# EasyEDA schematic Schematic_Smart watch system.json
TITLE: SMART WATCH SYSTEM; REV: 1.0; Date: 2025-03-30; Sheet: 1/1; Company: HCMUTE
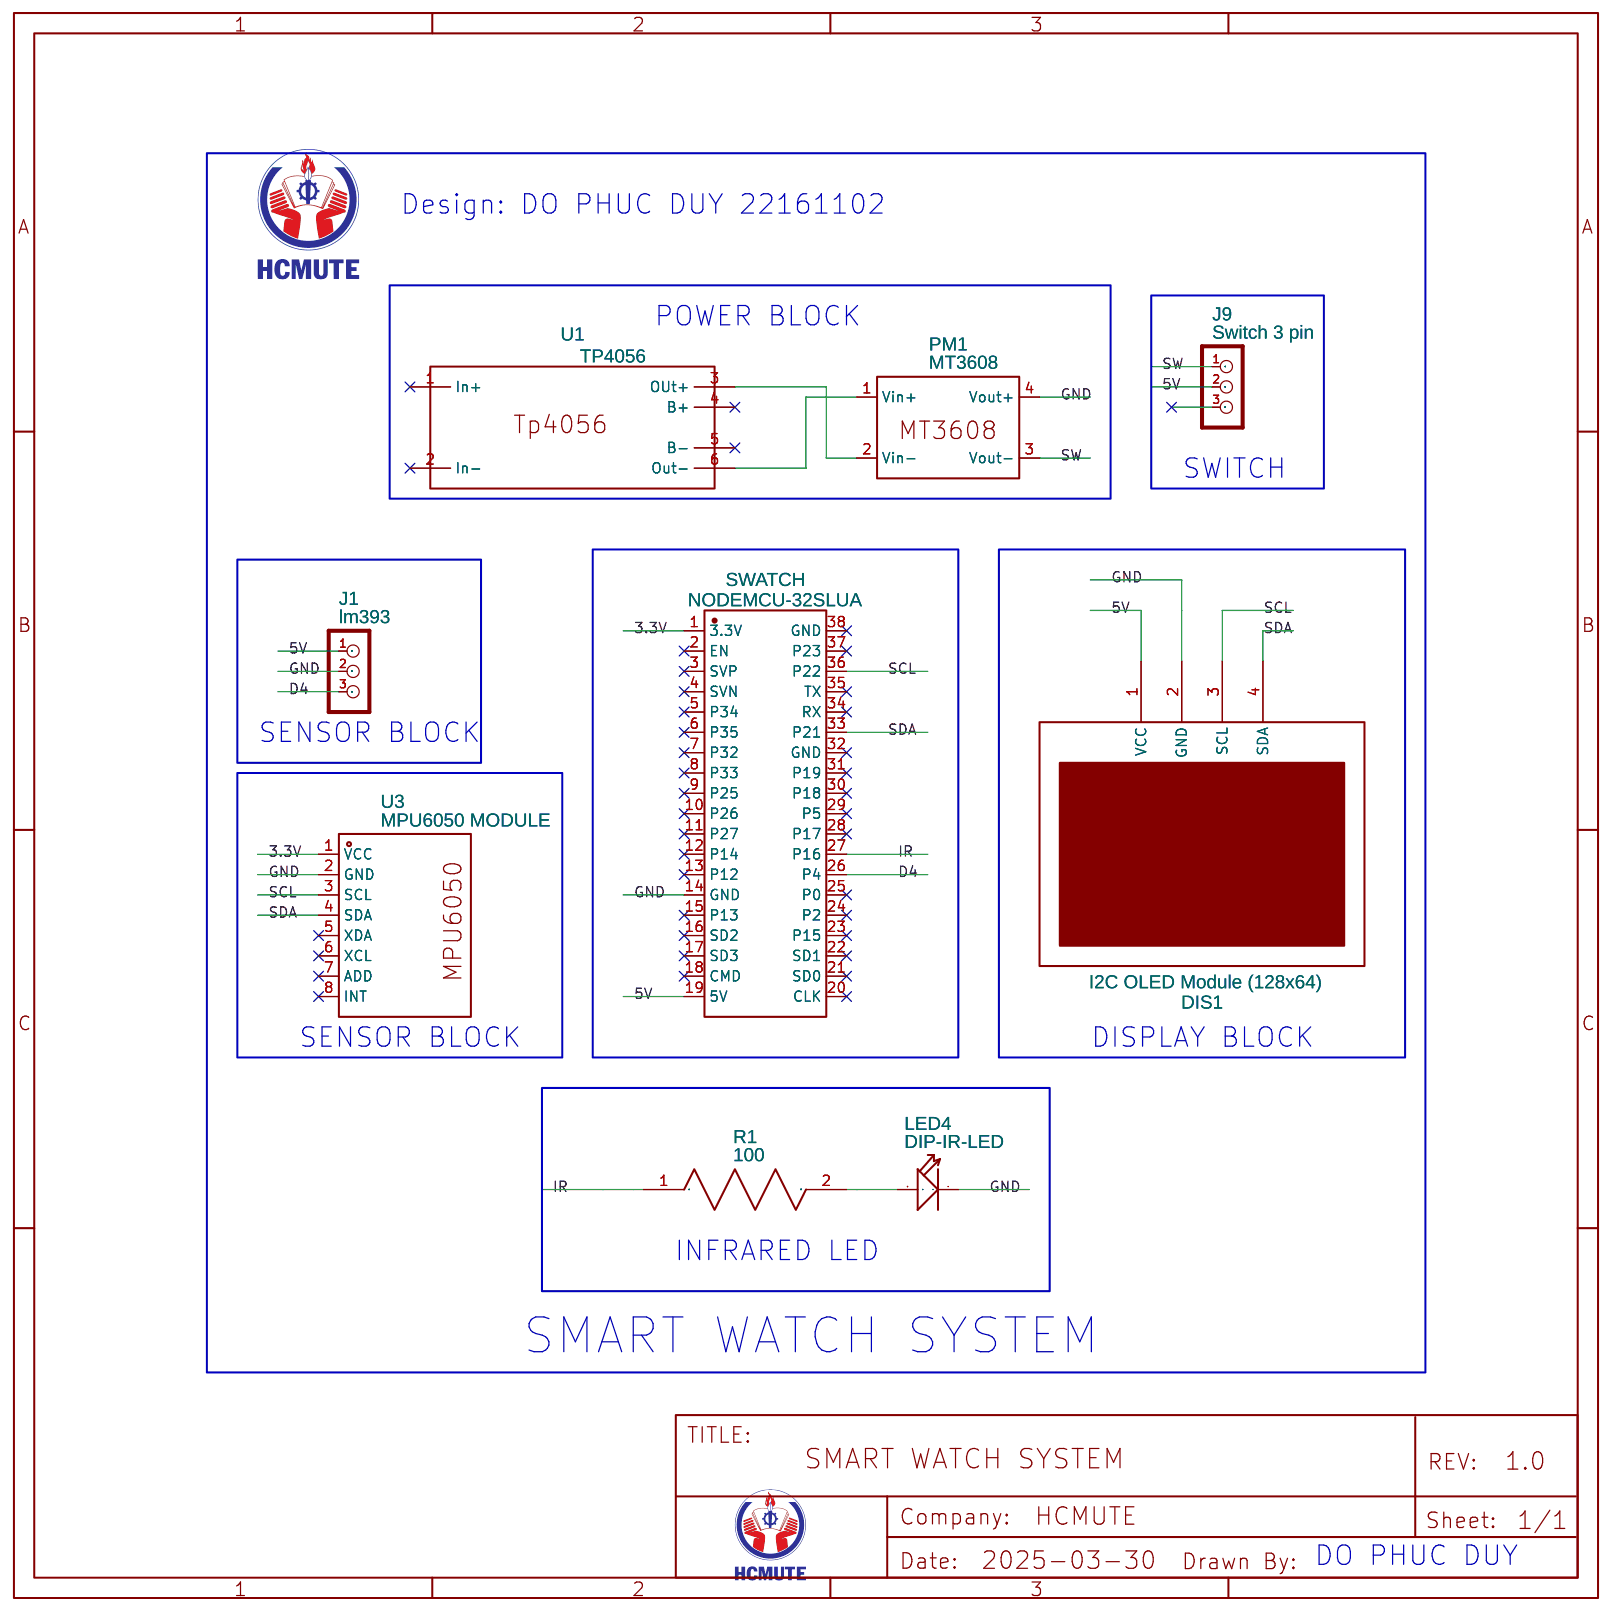
[diagram p0: schematic sheet]

## Parts
DIS1  I2C OLED Module (128x64)  [I2C OLED MODULE (128X64)]
J1  lm393  [M1X3]
J9  Switch 3 pin  [M1X3]
LED4  DIP-IR-LED  [LED2-2.54-D5.0MM]
PM1  MT3608  [MT3608]
R1  100  [R1005]
SWATCH  NODEMCU-32SLUA  [COMM-TH_NODEMCU-32SLUA]
U1  TP4056  [BATTMODULE]
U3  MPU6050 MODULE  [MPU6050]

## Library data of the parts
DIS1 = I2C OLED Module (128x64): Manufacturer Part: SSD1306; link: https://cdn-shop.adafruit.com/datasheets/SSD1306.pdf; Contributor: adzib_mchp
J1 J9 = CON_HEADER_1X03: Contributor: DangerousPrototype
LED4 = DIP-IR-LED-940NM(2P-D5MM): DIP IR LED 940nm; Supplier Part: 304090159; Supplier: SeeedStudio; Manufacturer Part: IR523B-W60W1; sourceId: iIBTN5nFX
PM1 = MT3608 MODULE_new: Supplier: AliExpress; link: https://www.banggood.com/1pcs-MT3608-2A-DC-DC-Adjustable-Step-Up-Power-Module-Booster-Power-Module-p-1213134.html?rmmds=myorder&cur_warehouse=CN; Contributor: stmo
R1 = 1K ohm resistor: Manufacturer: N/A; Manufacturer Part: N/A; Supplier: Western Sydney University; Supplier Part: SCC#10 - Lab in a Box; link: https://learn-ap-southeast-2-prod-fleet01-xythos.content.blackboardcdn.com/5df059da37b55/12173215?X-Blackboard-Expiration=1633014000000&X-Blackboard-Signature=z5FtfdzDMy1ultr1KULoEKHby0hrA%2BqKLvWZqL46r5c%3D&X-Blackboard-Client-Id=100287&response-cache-control=private%2C%20max-age%3D21600&response-content-disposition=inline%3B%20filename%2A%3DUTF-8%27%27300075-301121%2520PCB%2520Constraints%2520.pdf&response-content-type=application%2Fpdf&X-Amz-Algorithm=AWS4-HMAC-SHA256&X-Amz-Date=20210930T090000Z&X-Amz-SignedHeaders=host&X-Amz-Expires=21600&X-Amz-Credential=AKIAYDKQORRYZBCCQFY5%2F20210930%2Fap-southeast-2%2Fs3%2Faws4_request&X-Amz-Signature=6d14cd8af85140df6930e74546ceb214ae1e83564857a7b25a7bfc70eee0aa0d; Contributor: 22161102; Resistance: 1khom; Convert to PCB: Yes; Add into BOM: Yes
SWATCH = NODEMCU-32SLUA: Contributor: lcsc; Supplier: LCSC; Supplier Part: C111436; Manufacturer: Ai-Thinker(安信可); Manufacturer Part: NodeMCU-32SLua; JLCPCB Part Class: Extended Part
U1 = TP4056 Lithium Battery Charger Module: Contributor: 22161102; Supplier: Aliexpress
U3 = MPU6050 MODULE: Supplier: Aliexpress; Contributor: 22161102

## Nets
3.3V: SWATCH.1(3.3V) U3.1(VCC)
5V: DIS1.1(VCC) J1.1 J9.2 SWATCH.19(5V)
GND: DIS1.2(GND) J1.2 LED4.- PM1.4(Vout+) SWATCH.14(GND) U3.2(GND)
D4: J1.3 SWATCH.26(P4)
IR: R1.1 SWATCH.27(P16)
SCL: DIS1.3(SCL) SWATCH.36(P22) U3.3(SCL)
SDA: DIS1.4(SDA) SWATCH.33(P21) U3.4(SDA)
SW: J9.1 PM1.3(Vout-)
Net-(LED4-+): LED4.+ R1.2
Net-(PM1-1): PM1.1(Vin+) U1.6(Out-)
Net-(PM1-2): PM1.2(Vin-) U1.3(OUt+)

Not connected (* = marked no-connect by the designer): J9 3; SWATCH 2(EN)* 3(SVP)* 4(SVN)* 5(P34)* 6(P35)* 7(P32)* 8(P33)* 9(P25)* 10(P26)* 11(P27)* 12(P14)* 13(P12)* 15(P13)* 16(SD2)* 17(SD3)* 18(CMD)* 20(CLK)* 21(SD0)* 22(SD1)* 23(P15)* 24(P2)* 25(P0)* 28(P17)* 29(P5)* 30(P18)* 31(P19)* 32(GND)* 34(RX)* 35(TX)* 37(P23)* 38(GND)*; U1 1(In+)* 2(In-)* 4(B+)* 5(B-)*; U3 5(XDA)* 6(XCL)* 7(ADD)* 8(INT)*

## Notes on the sheet
- Design: DO PHUC DUY 22161102
- POWER BLOCK
- SWITCH
- SENSOR BLOCK
- SENSOR BLOCK
- DISPLAY BLOCK
- INFRARED LED
- SMART WATCH SYSTEM
- DO PHUC DUY
